# Altium project LaserLider.PrjPcb (part 3 of 4)

## Sheet VCSEL.SchDoc
size A4
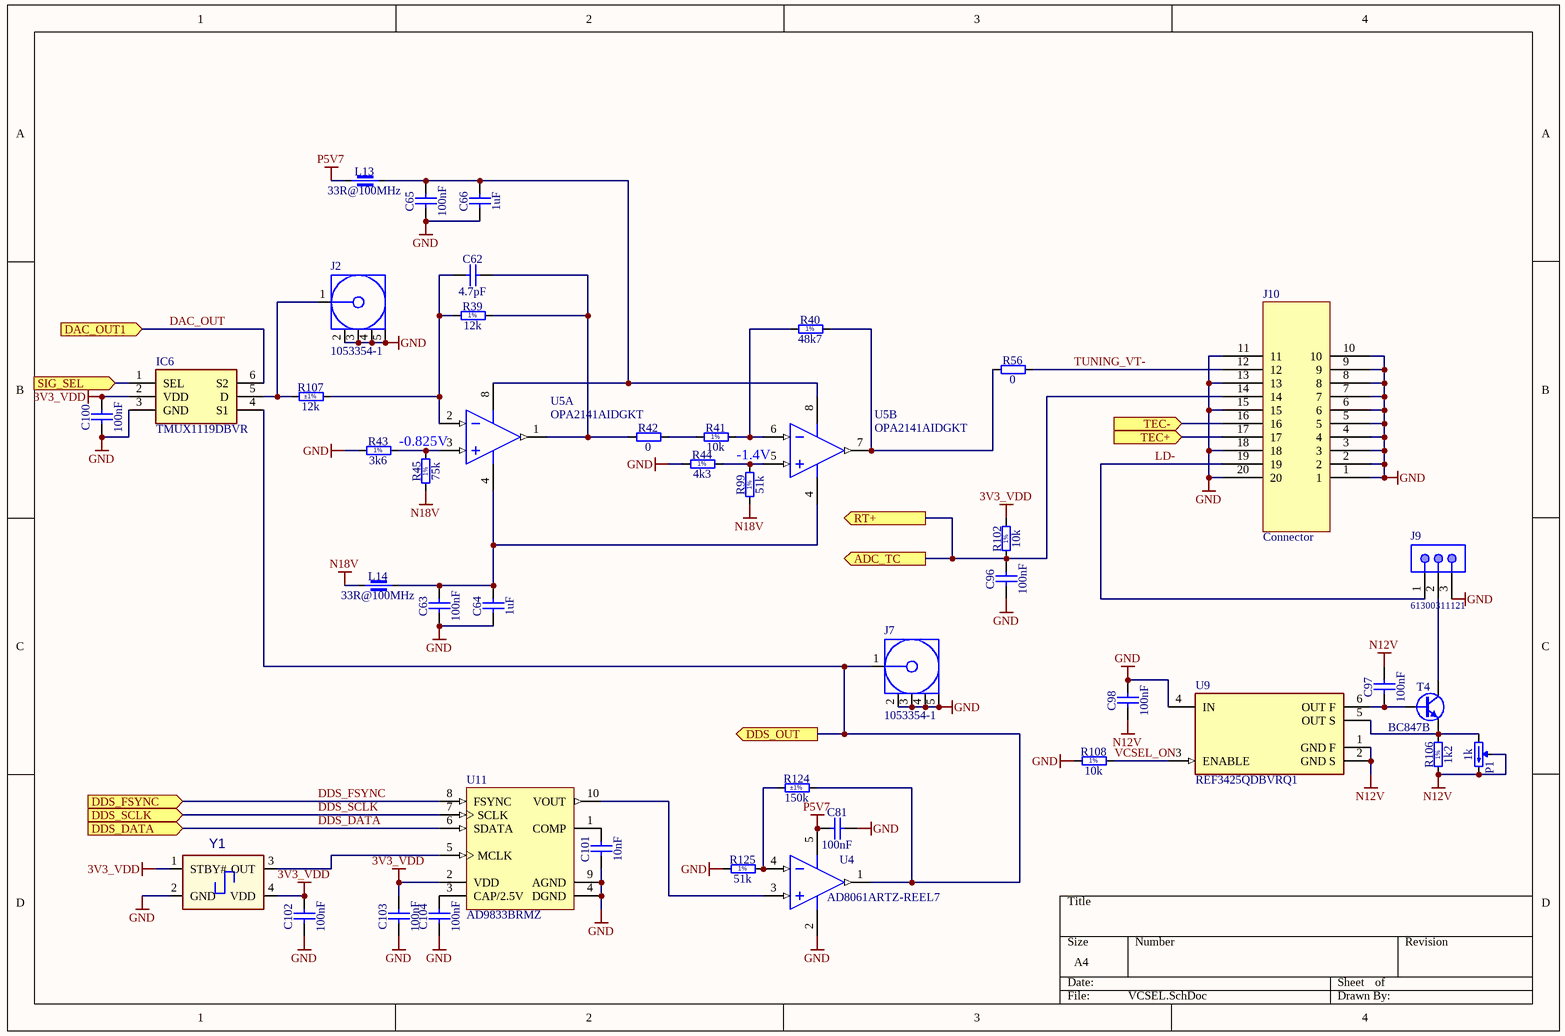
[diagram p4: VCSEL.SchDoc]

### Parts
C62  4.7pF  [CAPC1005X70N]
C63  100nF  [CAPC1608X87N]
C64  1uF  [CAPC1608X87N]
C65  100nF  [CAPC1005X55N]
C66  1uF  [CAPC1005X55N]
C81  100nF  [CAPC1005X55N]
C96  100nF  [CAPC1005X55N]
C97  100nF  [CAPC1005X55N]
C98  100nF  [CAPC1005X55N]
C100  100nF  [CAPC1005X55N]
C101  10nF  [CAPC1005X55N]
C102  100nF  [CAPC1005X55N]
C103  100nF  [CAPC1005X55N]
C104  100nF  [CAPC1005X55N]
IC6  TMUX1119DBVR  [SOT95P280X145-6N]
J2  1053354-1  [TECO-1053354-1_V]
J7  1053354-1  [TECO-1053354-1_V]
J9  61300311121  [61300311121]
J10  Connector  [VCSEL_CONNECTOR]
L13  33R@100MHz  [INDC1005X55N]
L14  33R@100MHz  [INDC1005X55N]
P1  1k  [TRIM_BOURNS_3266W]
R39  12k  [RESC1005X40N]
R40  48k7  [RESC1608X55N]
R41  10k  [RESC1005X40N]
R42  0  [RESC1005X40N]
R43  3k6  [RESC1005X40N]
R44  4k3  [RESC1005X40N]
R45  75k  [RESC1005X40N]
R56  0  [RESC1005X40N]
R99  51k  [RESC1005X40N]
R102  10k  [RESC1005X40N]
R106  1k2  [RESC1005X40N]
R107  12k  Tolerance: ±1%  [RESC1005X40N]
R108  10k  [RESC1005X40N]
R124  150k  Tolerance: ±1%  [RESC1005X40N]
R125  51k  [RESC1005X40N]
T4  BC847B  [SOT95P230X110-3N]
U4  AD8061ARTZ-REEL7  [ADI-RJ-5_L]
U5  OPA2141AIDGKT  [DGK0008A_M]  (parts A,B of 2)
U9  REF3425QDBVRQ1  [FP-DBV0006A-MFG]
U11  AD9833BRMZ  [ADI-RM-10_M]
Y1  OSCILLATOR_4P_nSTBY  [OSCILLATOR_CDFN_L2.5W2.0H0.85]  (value not drawn)

### Ports
ADC_TC (out), DAC_OUT1 (in), DDS_DATA (in), DDS_FSYNC (in), DDS_OUT (out), DDS_SCLK (in), RT+ (out), SIG_SEL (in), TEC+ (in), TEC- (in)

### Nets
3V3_VDD: C100.2 C102.2 C103.2 IC6.2(VDD) R102.2 U11.2(VDD) Y1.1(STBY#) Y1.4(VDD)
GND: C63.1 C64.1 C65.1 C66.1 C81.2 C96.1 C98.2 C100.1 C101.1 C102.1 C103.1 C104.1 IC6.3(GND) J2.2 J2.3 J2.4 J2.5 J7.2 J7.3 J7.4 J7.5 J9.3 J10.1 J10.2 J10.3 J10.4 J10.5 J10.6 J10.7 J10.8 J10.9 J10.10 J10.11 J10.13 J10.15 J10.18 J10.20 R43.1 R44.1 R108.1 R125.1 U4.2(-VS) U9.4(IN) U11.4(DGND) U11.9(AGND) Y1.2(GND)
N12V: C97.2 C98.1 P1.2(W) P1.3(CW) R106.1 U9.1(GND_F) U9.2(GND_S)
N18V: L14.1 R45.1 R99.1
P5V7: C81.1 L13.1 U4.5(+VS)
ADC_TC: C96.2 J10.14 R102.1 ; port ADC_TC, port RT+
COMP_IMP: IC6.4(S1) J7.1 R124.2 U4.1(VOUT) ; port DDS_OUT
DAC_OUT: IC6.6(S2) ; port DAC_OUT1
DDS_DATA: U11.6(SDATA) ; port DDS_DATA
DDS_FSYNC: U11.8(FSYNC) ; port DDS_FSYNC
DDS_SCLK: U11.7(SCLK) ; port DDS_SCLK
LD-: J9.1 J10.19
SIG_SEL: IC6.1(SEL) ; port SIG_SEL
TUNING_VT-: J10.12 R56.2
VCSEL_ON: R108.2 U9.3(ENABLE)
NetADN1_10: J10.16 ; port TEC-
NetADN1_17: J10.17 ; port TEC+
NetC62_1: C62.1 R39.1 R107.2 U5.2(IN_A-)
NetC62_2: C62.2 R39.2 R42.1 U5.1(OUT_A)
NetC63_2: C63.2 C64.2 L14.2 U5.4(V-)
NetC65_2: C65.2 C66.2 L13.2 U5.8(V+)
NetC97_1: C97.1 T4.1(B) U9.6(OUT_F)
NetC101_2: C101.2 U11.1(COMP)
NetC104_2: C104.2 U11.3(CAP/2.5V)
NetIC6_5: IC6.5(D) J2.1 R107.1
NetJ9_2: J9.2 T4.3(C)
NetP1_1: P1.1(CCW) R106.2 T4.2(E) U9.5(OUT_S)
NetR40_1: R40.1 R41.2 U5.6(IN_B-)
NetR40_2: R40.2 R56.1 U5.7(OUT_B)
NetR41_1: R41.1 R42.2
NetR43_2: R43.2 R45.2 U5.3(IN_A+)
NetR44_2: R44.2 R99.2 U5.5(IN_B+)
NetR124_1: R124.1 R125.2 U4.4(-IN)
NetU4_3: U4.3(+IN) U11.10(VOUT)
NetU11_5: U11.5(MCLK) Y1.3(OUT)

### Notes on the sheet
- -0.825V
- -1.4V
- (in symbol R0402_1K2_1%_0.0625W_100PPM) 1%
- (in symbol R0402_3K6_1%_0.0625W_100PPM) 1%
- (in symbol R0402_4K3_1%_0.0625W_100PPM) 1%
- (in symbol R0402_10K_1%_0.0625W_100PPM) 1%
- (in symbol R0402_12K_1%_0.0625W_100PPM) 1%
- (in symbol R0402_51K_1%_0.0625W_100PPM) 1%
- (in symbol R0402_75K_1%_0.0625W_100PPM) 1%
- (in symbol R0603_48K7_1%_0.1W_100PPM) 1%

### Library data of the parts
C62 = CC0402_4.7PF_50V_0.25PF_C0G_VISHAY_VJ_NON-MAGNETIC: Non-polarised capacitor; Part Description: Surface Mount Multilayer Ceramic Chip Capacitors for Non-Magnetic Applications (IR Reflow Soldering); Manufacturer: VISHAY VITRAMON; Manufacturer Part Number: VJ0402A4R7CCAA; Voltage: 50V; TC: C0G/NP0; Tolerance: ±0.25pF; Part Number: CC0402_4.7PF_50V_0.25PF_C0G_VISHAY_VJ_NON-MAGNETIC; Component Kind: Standard; Component Type: Standard; Pin Count: 2; Value: 4.7pF; Status: Not Recommended; Case: 0402; Mounted: Yes; Socket: No; SMD: Yes; Sense: No; ComponentHeight: 0.64mm; HelpURL: \\cern.ch\dfs\Applications\Altium\Datasheets\CC0402_VISHAY_VJ_NON-MAGNETIC.pdf; Author: CERN DEM MR; CreateDate: 03.03.2017; LatestRevisionDate: 03.03.2017
C63 = CC0603_100NF_50V_10%_X5R: Non-polarised capacitor; Part Description: SMD Multilayer Chip Ceramic Capacitor; Manufacturer: GENERIC; Manufacturer1 Part Number: C1608X5R1H104K080; Voltage: 50V; TC: X5R; Tolerance: ±10%; Part Number: CC0603_100NF_50V_10%_X5R; Component Kind: Standard; Component Type: Standard; Pin Count: 2; Value: 100nF; Status: None; Manufacturer Part Number: CC0603_100NF_50V_10%_X5R; Case: 0603; Mounted: Yes; Socket: No; SMD: Yes; Sense: No; Manufacturer1 Example: TDK; Manufacturer1 ComponentHeight: 0.9mm; HelpURL: \\cern.ch\dfs\Applications\Altium\Datasheets\CC0603_X5R_TDK_C.pdf; Author: CERN DEM MR; CreateDate: 08.01.2016; LatestRevisionDate: 08.01.2016
C64 = CC0603_1UF_25V_10%_X7R: Non-polarised capacitor; Part Description: SMD Multilayer Chip Ceramic Capacitor; Manufacturer: GENERIC; Manufacturer1 Part Number: GRM188R71E105KA12D; Voltage: 25V; TC: X7R; Tolerance: ±10%; Part Number: CC0603_1UF_25V_10%_X7R; Component Kind: Standard; Component Type: Standard; Pin Count: 2; Value: 1uF; Status: None; Manufacturer Part Number: CC0603_1UF_25V_10%_X7R; Case: 0603; Mounted: Yes; Socket: No; SMD: Yes; Sense: No; Manufacturer1 Example: MURATA; Manufacturer1 ComponentHeight: 0.9mm; HelpURL: \\cern.ch\dfs\Applications\Altium\Datasheets\CC0603_X7R_MURATA.pdf; Author: CERN DEM JLC; CreateDate: 18.01.2011; LatestRevisionDate: 18.01.2011
C65 C81 C96-C98 C100 C102-C104 = CC0402_100NF_16V_10%_X7R: Non-polarised capacitor; Part Description: SMD Multilayer Chip Ceramic Capacitor; Manufacturer: GENERIC; Manufacturer1 Part Number: GRM155R71C104KA88D; Voltage: 16V; TC: X7R; Tolerance: ±10%; Part Number: CC0402_100NF_16V_10%_X7R; Component Kind: Standard; Component Type: Standard; Pin Count: 2; Value: 100nF; Status: Not Recommended; Manufacturer Part Number: CC0402_100NF_16V_10%_X7R; Case: 0402; Mounted: Yes; Socket: No; SMD: Yes; Sense: No; Manufacturer1 Example: MURATA; Manufacturer1 ComponentHeight: 0.55mm; HelpURL: \\cern.ch\dfs\Applications\Altium\Datasheets\CC0402_X7R_MURATA_GRM.pdf; Author: CERN DEM JLC; CreateDate: 05.12.2013; LatestRevisionDate: 03.12.2007
C66 = CC0402_1UF_16V_10%_X5R: Non-polarised capacitor; Part Description: SMD Multilayer Chip Ceramic Capacitor; Manufacturer: GENERIC; Manufacturer1 Part Number: C1005X5R1C105KT; Voltage: 16V; TC: X5R; Tolerance: ±10%; Part Number: CC0402_1UF_16V_10%_X5R; Component Kind: Standard; Component Type: Standard; Pin Count: 2; Value: 1uF; Status: Preferred; Manufacturer Part Number: CC0402_1UF_16V_10%_X5R; Case: 0402; Mounted: Yes; Socket: No; SMD: Yes; Sense: No; Manufacturer1 Example: TDK; Manufacturer1 ComponentHeight: 0.55mm; HelpURL: \\cern.ch\dfs\Applications\Altium\Datasheets\CC0402_X5R_TDK_C.pdf; Author: CERN DEM JLC; CreateDate: 25.10.2012; LatestRevisionDate: 25.10.2012
C101 = CC0402_10NF_16V_10%_X7R: Non-polarised capacitor; Part Description: SMD Multilayer Chip Ceramic Capacitor; Manufacturer: GENERIC; Manufacturer1 Part Number: 223878715636; Voltage: 16V; TC: X7R; Tolerance: ±10%; Part Number: CC0402_10NF_16V_10%_X7R; Component Kind: Standard; Component Type: Standard; Pin Count: 2; Value: 10nF; Status: Not Recommended; Manufacturer Part Number: CC0402_10NF_16V_10%_X7R; Case: 0402; Mounted: Yes; Socket: No; SMD: Yes; Sense: No; Manufacturer1 Example: PHYCOMP; Manufacturer1 ComponentHeight: 0.55mm; HelpURL: \\cern.ch\dfs\Applications\Altium\Datasheets\CC0402_X7R_PHYCOMP.pdf; Author: CERN DEM JLC; CreateDate: 03.12.2007; LatestRevisionDate: 03.12.2007
IC6 = TMUX1119DBVR: Integrated Circuit; Manufacturer_Name: Texas Instruments; Datasheet Link: https://www.ti.com/lit/gpn/TMUX1119; Height: 1.45mm; Manufacturer_Part_Number: TMUX1119DBVR
J2 J7 = CMP-2000-05830-1: Female Coaxial Connector, Pitch 2.55 mm, Height 9.5 mm, Tail Length 3.9 mm, RoHS, Bulk; Manufacturer: TE Connectivity; Dynamic Catalog: SMA; Impedance: 50Ohm; Contact Termination: Solder; Connector Type: Jack,FemaleSockets; 3D Model: 1053354-1.pdf; Other Names: 2062000000 / A30046; Datasheet Version: Rev. B, 05/2011; Package Reference: 1053354-1; RoHS Information: 1053354-1StatementofCompliance; Series: SMA; Connector Style: SMA; Family: CoaxialConnectors(RF); Category: Connectors,Interconnects; Fastening Type: Threaded; Standard Package: 125; Mounting Type: ThroughHole; Packaging: Bulk; Datasheet URL: http://www.te.com/commerce/DocumentDelivery/DDEController?Action=srchrtrv&DocNm=1053354&DocType=Customer+Drawing&DocLang=English; Mounting Technology: ThroughHole; Manufacturer URL: http://www.te.com/; Package Description: Female Coaxial Connector, Pitch 2.55 mm, Height 9.5 mm, Tail Length 3.9 mm
J9 = 61300311121: WR-PHD Pin Header, THT, pitch 2.54mm, Single Row, Vertical, 3pin; Pin Number: 3; Gender: Male; Rated Current: 3A; Working Voltage: 250VAC; Withstanding Voltage: 500VAC; Contact Resistance: 20mOhm; ComponentLink1Description: Manufacturer; ComponentLink1URL: http://www.we-online.de; ComponentLink2Description: Datasheet; ComponentLink2URL: https://katalog.we-online.de/em/datasheet/6130xx11121.pdf; Part Number: 61300311121; Published Date: June 2019; Publisher: Wurth Elektronik; Pitch: 2.54mm; Operating Temperature: -40 to +105degC; Mounting Technology: THT; Packaging: Bag; Row Number: Single; Orientation: Vertical
J10 = VCSEL_CONNECTOR: VCSEL connector
L13 L14 = IND0402_MURATA_BLM15PX330SN1D: Part Description: SMD EMIFIL Chip Ferrite Bead; Manufacturer: MURATA; Power: 3A; Resistance: 0.022R; Tolerance: ±25%; Part Number: IND0402_MURATA_BLM15PX330SN1D; Component Kind: Standard; Component Type: Standard; Pin Count: 2; Value: 33R@100MHz; Status: None; Manufacturer Part Number: BLM15PX330SN1D; Case: 0402; Mounted: Yes; Socket: No; SMD: Yes; Sense: No; ComponentHeight: 0.55mm; HelpURL: \\cern.ch\dfs\Applications\Altium\Datasheets\IND0402_MURATA_BLM15PX.pdf; Author: CERN DEM JMW; CreateDate: 19.02.2014; LatestRevisionDate: 25.10.2018
P1 = TRIM_12T_1K_BOURNS_3266W-1-102LF: Trimming Potentiometer; Part Description: 12 Turn Trimming Potentiometer (Top Adjustment); Manufacturer: BOURNS; Power: 0.25W; TC: ±100ppm/°C; Tolerance: ±10%; PressFit: No; Part Number: TRIM_12T_1K_BOURNS_3266W-1-102LF; Component Kind: Standard; Component Type: Standard; Pin Count: 3; Value: 1k; Manufacturer Part Number: 3266W-1-102LF; Case: 3266W; Mounted: Yes; Socket: No; SMD: No; Sense: No; ComponentHeight: 7.75mm; HelpURL: \\cern.ch\dfs\Applications\Altium\Datasheets\TRIM_BOURNS_3266W.pdf; Author: CERN DEM JLC; CreateDate: 10.06.2008; LatestRevisionDate: 28.11.2012
R39 = R0402_12K_1%_0.0625W_100PPM: Resistor - 1%; Part Description: General Purpose Thick Film Chip Resistor; Manufacturer: GENERIC; Manufacturer1 Part Number: 232270671203L; TC: ±100ppm/°C; PressFit: No; Part Number: R0402_12K_1%_0.0625W_100PPM; Component Kind: Standard; Component Type: Standard; Pin Count: 2; Value: 12k; Status: Not Recommended; Power: 0.0625W; Tolerance: ±1%; Manufacturer Part Number: R0402_12K_1%_0.0625W_100PPM; Case: 0402; Mounted: Yes; Sense: No; Socket: No; SMD: Yes; Manufacturer1 Example: YAGEO PHYCOMP; Manufacturer1 ComponentHeight: 0.4mm; HelpURL: \\cern.ch\dfs\Applications\Altium\Datasheets\R0402_Phycomp_RC0402.pdf; Author: CERN DEM JLC; CreateDate: 03.12.2007; LatestRevisionDate: 17.10.2012
R40 = R0603_48K7_1%_0.1W_100PPM: Resistor - 1%; Part Description: General Purpose Thick Film Chip Resistor; Manufacturer: GENERIC; Manufacturer1 Part Number: CRCW060348K7FKEA; Power: 0.1W; TC: ±100ppm/°C; PressFit: No; Part Number: R0603_48K7_1%_0.1W_100PPM; Component Kind: Standard; Component Type: Standard; Pin Count: 2; Value: 48k7; Status: Preferred; Tolerance: ±1%; Manufacturer Part Number: R0603_48K7_1%_0.1W_100PPM; Case: 0603; Mounted: Yes; Sense: No; Socket: No; SMD: Yes; Manufacturer1 Example: VISHAY; Manufacturer1 ComponentHeight: 0.55mm; HelpURL: \\cern.ch\dfs\Applications\Altium\Datasheets\R0603_VISHAY_CRCW e3.pdf; Author: CERN DEM JLC; CreateDate: 15.07.2010; LatestRevisionDate: 11.12.2013
R41 R102 R108 = R0402_10K_1%_0.0625W_100PPM: Resistor - 1%; Part Description: General Purpose Thick Film Chip Resistor; Manufacturer: GENERIC; Manufacturer1 Part Number: 232270671003L; TC: ±100ppm/°C; PressFit: No; Part Number: R0402_10K_1%_0.0625W_100PPM; Component Kind: Standard; Component Type: Standard; Pin Count: 2; Value: 10k; Status: Not Recommended; Power: 0.0625W; Tolerance: ±1%; Manufacturer Part Number: R0402_10K_1%_0.0625W_100PPM; Case: 0402; Mounted: Yes; Sense: No; Socket: No; SMD: Yes; Manufacturer1 Example: YAGEO PHYCOMP; Manufacturer1 ComponentHeight: 0.4mm; HelpURL: \\cern.ch\dfs\Applications\Altium\Datasheets\R0402_Phycomp_RC0402.pdf; Author: CERN DEM JLC; CreateDate: 03.12.2007; LatestRevisionDate: 17.10.2012
R42 R56 = R0402_0R_JUMPER: Resistor; Part Description: 1A (0.05R Max DC Resistance) Zero Ohm Jumper; Manufacturer: GENERIC; Manufacturer1 Part Number: 232270591001L; PressFit: No; Part Number: R0402_0R_JUMPER; Component Kind: Standard; Component Type: Standard; Pin Count: 2; Value: 0; Status: Not Recommended; Manufacturer Part Number: R0402_0R_JUMPER; Case: 0402; Mounted: Yes; Sense: No; Socket: No; SMD: Yes; Manufacturer1 Example: YAGEO PHYCOMP; Manufacturer1 ComponentHeight: 0.4mm; HelpURL: \\cern.ch\dfs\Applications\Altium\Datasheets\R0402_Phycomp_RC0402.pdf; Author: CERN DEM JLC; CreateDate: 03.12.2007; LatestRevisionDate: 17.10.2012
R43 = R0402_3K6_1%_0.0625W_100PPM: Resistor - 1%; Part Description: General Purpose Thick Film Chip Resistor; Manufacturer: GENERIC; Manufacturer1 Part Number: 232270673602L; TC: ±100ppm/°C; PressFit: No; Part Number: R0402_3K6_1%_0.0625W_100PPM; Component Kind: Standard; Component Type: Standard; Pin Count: 2; Value: 3k6; Status: Not Recommended; Power: 0.0625W; Tolerance: ±1%; Manufacturer Part Number: R0402_3K6_1%_0.0625W_100PPM; Case: 0402; Mounted: Yes; Sense: No; Socket: No; SMD: Yes; Manufacturer1 Example: YAGEO PHYCOMP; Manufacturer1 ComponentHeight: 0.4mm; HelpURL: \\cern.ch\dfs\Applications\Altium\Datasheets\R0402_Phycomp_RC0402.pdf; Author: CERN DEM JLC; CreateDate: 03.12.2007; LatestRevisionDate: 17.10.2012
R44 = R0402_4K3_1%_0.0625W_100PPM: Resistor - 1%; Part Description: General Purpose Thick Film Chip Resistor; Manufacturer: GENERIC; Manufacturer1 Part Number: 232270674302L; TC: ±100ppm/°C; PressFit: No; Part Number: R0402_4K3_1%_0.0625W_100PPM; Component Kind: Standard; Component Type: Standard; Pin Count: 2; Value: 4k3; Status: Not Recommended; Power: 0.0625W; Tolerance: ±1%; Manufacturer Part Number: R0402_4K3_1%_0.0625W_100PPM; Case: 0402; Mounted: Yes; Sense: No; Socket: No; SMD: Yes; Manufacturer1 Example: YAGEO PHYCOMP; Manufacturer1 ComponentHeight: 0.4mm; HelpURL: \\cern.ch\dfs\Applications\Altium\Datasheets\R0402_Phycomp_RC0402.pdf; Author: CERN DEM JLC; CreateDate: 03.12.2007; LatestRevisionDate: 17.10.2012
R45 = R0402_75K_1%_0.0625W_100PPM: Resistor - 1%; Part Description: General Purpose Thick Film Chip Resistor; Manufacturer: GENERIC; Manufacturer1 Part Number: 232270677503L; TC: ±100ppm/°C; PressFit: No; Part Number: R0402_75K_1%_0.0625W_100PPM; Component Kind: Standard; Component Type: Standard; Pin Count: 2; Value: 75k; Status: Not Recommended; Power: 0.0625W; Tolerance: ±1%; Manufacturer Part Number: R0402_75K_1%_0.0625W_100PPM; Case: 0402; Mounted: Yes; Sense: No; Socket: No; SMD: Yes; Manufacturer1 Example: YAGEO PHYCOMP; Manufacturer1 ComponentHeight: 0.4mm; HelpURL: \\cern.ch\dfs\Applications\Altium\Datasheets\R0402_Phycomp_RC0402.pdf; Author: CERN DEM JLC; CreateDate: 03.12.2007; LatestRevisionDate: 17.10.2012
R99 R125 = R0402_51K_1%_0.0625W_100PPM: Resistor - 1%; Part Description: General Purpose Thick Film Chip Resistor; Manufacturer: GENERIC; Manufacturer1 Part Number: 232270674703L; TC: ±100ppm/°C; PressFit: No; Part Number: R0402_51K_1%_0.0625W_100PPM; Component Kind: Standard; Component Type: Standard; Pin Count: 2; Value: 51k; Status: Not Recommended; Power: 0.0625W; Tolerance: ±1%; Manufacturer Part Number: R0402_51K_1%_0.0625W_100PPM; Case: 0402; Mounted: Yes; Sense: No; Socket: No; SMD: Yes; Manufacturer1 Example: YAGEO PHYCOMP; Manufacturer1 ComponentHeight: 0.4mm; HelpURL: \\cern.ch\dfs\Applications\Altium\Datasheets\R0402_Phycomp_RC0402.pdf; Author: CERN DEM JLC; CreateDate: 03.12.2007; LatestRevisionDate: 17.10.2012
R106 = R0402_1K2_1%_0.0625W_100PPM: Resistor - 1%; Part Description: General Purpose Thick Film Chip Resistor; Manufacturer: GENERIC; Manufacturer1 Part Number: 232270671202L; TC: ±100ppm/°C; PressFit: No; Part Number: R0402_1K2_1%_0.0625W_100PPM; Component Kind: Standard; Component Type: Standard; Pin Count: 2; Value: 1k2; Status: Not Recommended; Power: 0.0625W; Tolerance: ±1%; Manufacturer Part Number: R0402_1K2_1%_0.0625W_100PPM; Case: 0402; Mounted: Yes; Sense: No; Socket: No; SMD: Yes; Manufacturer1 Example: YAGEO PHYCOMP; Manufacturer1 ComponentHeight: 0.4mm; HelpURL: \\cern.ch\dfs\Applications\Altium\Datasheets\R0402_Phycomp_RC0402.pdf; Author: CERN DEM JLC; CreateDate: 03.12.2007; LatestRevisionDate: 17.10.2012
R107 = R0402_12K_1%_0.0625W_100PPM: Resistor - 1%; Part Description: General Purpose Thick Film Chip Resistor; Manufacturer: GENERIC; Manufacturer1 Part Number: 232270671203L; PressFit: No; TC: ±100ppm/°C; Part Number: R0402_12K_1%_0.0625W_100PPM; Component Kind: Standard; Component Type: Standard; Pin Count: 2; Value: 12k; Status: Not Recommended; Manufacturer Part Number: R0402_12K_1%_0.0625W_100PPM; Case: 0402; Mounted: Yes; Sense: No; Socket: No; SMD: Yes; Manufacturer1 Example: YAGEO PHYCOMP; Manufacturer1 ComponentHeight: 0.4mm; HelpURL: \\cern.ch\dfs\Applications\Altium\Datasheets\R0402_Phycomp_RC0402.pdf; Author: CERN DEM JLC; CreateDate: 03.12.2007; LatestRevisionDate: 17.10.2012; Power: 0.0625W
R124 = R0402_150K_1%_0.0625W_100PPM: Resistor - 1%; Part Description: General Purpose Thick Film Chip Resistor; Manufacturer: GENERIC; Manufacturer1 Part Number: 232270671504L; TC: ±100ppm/°C; PressFit: No; Part Number: R0402_150K_1%_0.0625W_100PPM; Component Kind: Standard; Component Type: Standard; Pin Count: 2; Value: 150k; Status: Not Recommended; Power: 0.0625W; Manufacturer Part Number: R0402_150K_1%_0.0625W_100PPM; Case: 0402; Mounted: Yes; Sense: No; Socket: No; SMD: Yes; Manufacturer1 Example: YAGEO PHYCOMP; Manufacturer1 ComponentHeight: 0.4mm; HelpURL: \\cern.ch\dfs\Applications\Altium\Datasheets\R0402_Phycomp_RC0402.pdf; Author: CERN DEM JLC; CreateDate: 03.12.2007; LatestRevisionDate: 17.10.2012
T4 = BC847B: NPN Transistor; Part Description: 45V 100mA NPN general-purpose transistors; Manufacturer: NXP SEMICONDUCTORS; PressFit: No; Bonding: No; Part Number: BC847B; Component Kind: Standard; Component Type: Standard; Device: BC847B; PackageDescription: SOT23, 0.95mm Pitch; 3 Pin, 1.30mm W X 2.90mm L X 1.10mm H body, IPC Medium Density; Manufacturer Part Number: BC847B; Pin Count: 3; Case: SOT23-3; Mounted: Yes; Socket: No; SMD: Yes; Sense: No; ComponentHeight: 1.1mm; HelpURL: \\cern.ch\dfs\Applications\Altium\Datasheets\BC847B.pdf; Author: CERN DEM JLC; CreateDate: 14.06.2011; LatestRevisionDate: 14.06.2011
U4 = CMP-0384-01491-2: Single Channel Low Offset Voltage Operational Amplifier, 320 MHz BW, 650 V/us SR, Industrial, 5-pin SOT23 (RJ-5), Reel; Generic Part Number: AD8061; Manufacturer: Analog Devices; Iq/Amp: 9.5mA; V Span Min: 2.7V; Input Offset Voltage: 1mV; Input Bias Current: 350nA; Small Signal Bandwidth: 320MHz; Amplifiers Per Package: 1; V Span Max: 8V; PartNumber: AD8061ARTZ-REEL7; ComponentLink3Description: Package Specification; PackageReference: RJ-5; PackageVersion: 121608-A; RevisionNote: Symbol corrected, Pin 2 orientation reversed; ComponentLink1URL: http://www.analog.com/en/index.html; ComponentLink1Description: Manufacturer URL; ComponentLink2URL: http://www.analog.com/static/imported-files/data_sheets/AD8061_8062_8063.pdf; ComponentLink2Description: Datasheet; Code_JEDEC: MO-178-AA; Slew Rate: 650V/us; DatasheetVersion: Rev. G; PackageDescription: 5-Pin Small Outline Transistor Package, Body 2.9 x 1.6 mm, Pitch 0.95 mm; ComponentLink3URL: http://www.analog.com/static/imported-files/packages/PKG_PDF/SOT-23(RJ)/RJ_5.pdf; Mounting Technology: Surface Mount
U5 = CMP-0272-01226-3: 10 MHz, Single Supply, Low Noise, JFET Precision Amplifier, 4.5 to 36 V, -40 to 125 degC, 8-pin SOP (DGK8), Green (RoHS & no Sb/Br); Manufacturer: Texas Instruments; CMRR(Min)(dB): 120; IIB(Max)(pA): 20; Number of Channels: 2; Rating: Catalog; Packing: SMALL T&R; Total Supply Voltage(Max)(+5V is 5, +/-5V is 10): 36; Iq per channel(Max)(mA): 2.3; Vio (25C)(Max)(mV): 3.5; Total Supply Voltage(Min)(+5V is 5, +/-5V is 10): 4.5; Sub Family: High Supply Voltage Amplifier (>=30V), Low Noise Amp (<=10nV/rtHz), Precision Amplifier; GBW(Typ)(MHz): 10; Eco-Plan: Green (RoHS & no Sb/Br); ComponentLink1Description: Manufacturer URL; ComponentLink1URL: http://www.ti.com/; Slew Rate(Typ)(V/us): 20; PackageDescription: 8-Pin Thin Small Outline, Body 3 x 3 mm, Pitch 0.65 mm; DatasheetVersion: SBOS510B; ComponentLink2Description: Datasheet; ComponentLink3URL: http://www.ti.com/litv/pdf/mpds028d; ComponentLink3Description: Package Specification; PackageReference: DGK0008A; PackageVersion: 4073329/E, 05/2006; PartNumber: OPA2141AIDGKT; Mounting Technology: Surface Mount; Code_JEDEC: MO-187; ComponentLink2URL: http://www.ti.com/lit/ds/symlink/opa2141.pdf; Offset Drift(Typ)(uV/C): 2
U9 = CMP-04916-000005-1: IC VREF SERIES 0.05% SOT23-6; Manufacturer: Texas Instruments; Output Voltage: 2.5V; Max Supply Voltage: 12V; Output Type: Fixed; Automotive Grade: Grade 1; Number Of Outputs: 1; Output Current: 10mA; Nominal Supply Current: 72uA; Standoff Height: 0mm; Temperature: -40°C to +125°C; Temperature Range Low: -40°C; ComponentLink2Description: Datasheet; Manufacturer Part Number: REF3425QDBVRQ1; Device Class L2: Power Management ICs; RoHS: TRUE; Temperature Range High: +125°C; Digikey Description: IC VREF SERIES 0.05% SOT23-6; Octopart: https://octopart.com/ref3433qdbvrq1-texas+instruments-95842010; ComponentLink2URL: https://www.ti.com/lit/ds/symlink/ref34-q1.pdf; Mouser Description: Automotive low-drift low-power small-footprint series voltage reference 6-SOT-23 -40 to 125; Package: DBV0006A; Ambient Temperature Range High: +125°C; Device Class L1: Integrated Circuits (ICs); Device Class L3: Voltage References; Category: IC; Height: 1.45mm; Lead Free: Yes; Automotive: Yes; Reference Type: Series; Ambient Temperature Range Low: -40°C
U11 = CMP-0293-00077-1: Low Power, 12.65 mW, 2.3 V to 5.5 V, Programmable Waveform Generator, 10-Bit, Serial, RM-10, 50 Tube, Pb-Free; Resolution (Bits): 10bit; Compliance Range (V): 650mV; FS Iout (mA nom): 3mA; REFCLK Multiplier: No; Master fclk: 25MHz; I Supply total (max): 5.5mA; Tuning Word Width (bits): 28bit; Code_JEDEC: MO-187-BA; DatasheetVersion: Rev. D; PackageVersion: 5/8/2005; ComponentLink1URL: www.analog.com; ComponentLink3Description: Package Specification; PackageDescription: 10-Lead Mini Small Outline Package [MSOP]; I/O Interface: Serial; ComponentLink2Description: Datasheet; ComponentLink1Description: Manufacturer URL; PackageReference: RM-10; ComponentLink2URL: http://www.analog.com/static/imported-files/data_sheets/AD9833.pdf; ComponentLink3URL: http://www.analog.com/static/imported-files/packages/PKG_PDF/MSOP%28RM%29/RM_10.pdf
Y1 = MIC8253: Manufacturer 1: Microchip Technology; Manufacturer Part Number 1: DSC1001CI2-025.0000; Description_: MCHP CLOCK OSCILLATOR SINGLE 25MHZ DSC1001CI2-025.0000 CDFN-4; Dev Tools Status: Production; Value: 25MHz; Owner: Sam Charles; Populated: YES; Revision: 1; MCHP-ID: MIC8253; Symbol: OSCILLATOR_4P_nSTBY; Status: MCL Design; ComponentLink1URL: https://chn-vm-apps.microchip.com/mchprepo/parts/Datasheets/20005529B.pdf; ComponentLink1Description: SVN Datasheet; ComponentLink2URL: C:\ALTIUM_WORK\00001_MCHP-CDB\Datasheets\20005529B.pdf; ComponentLink2Description: Local Datasheet; ComponentLink3URL: C:\ALTIUM_WORK\00001_MCHP-CDB\Library\LibraryRefs\OSCILLATOR_4P_nSTBY.SchLib; ComponentLink3Description: Open Symbol; ComponentLink4URL: C:\ALTIUM_WORK\00001_MCHP-CDB\Library\Footprints\OSCILLATOR_CDFN_L2.5W2.0H0.85.PcbLib; ComponentLink4Description: Open Footprint; ComponentLink5Description: Open Footprint 2; ComponentLink6Description: Open Footprint 3; ComponentLink7Description: Open Footprint 4; Category: MCHP-Clock/Timing; Type: Oscillator; Supplier 1: Digi-Key; Supplier Part Number 1: DSC1001CI2-025.0000CT-ND; Quantity Override: 1

## Sheet Photoreciever.SchDoc
size A4
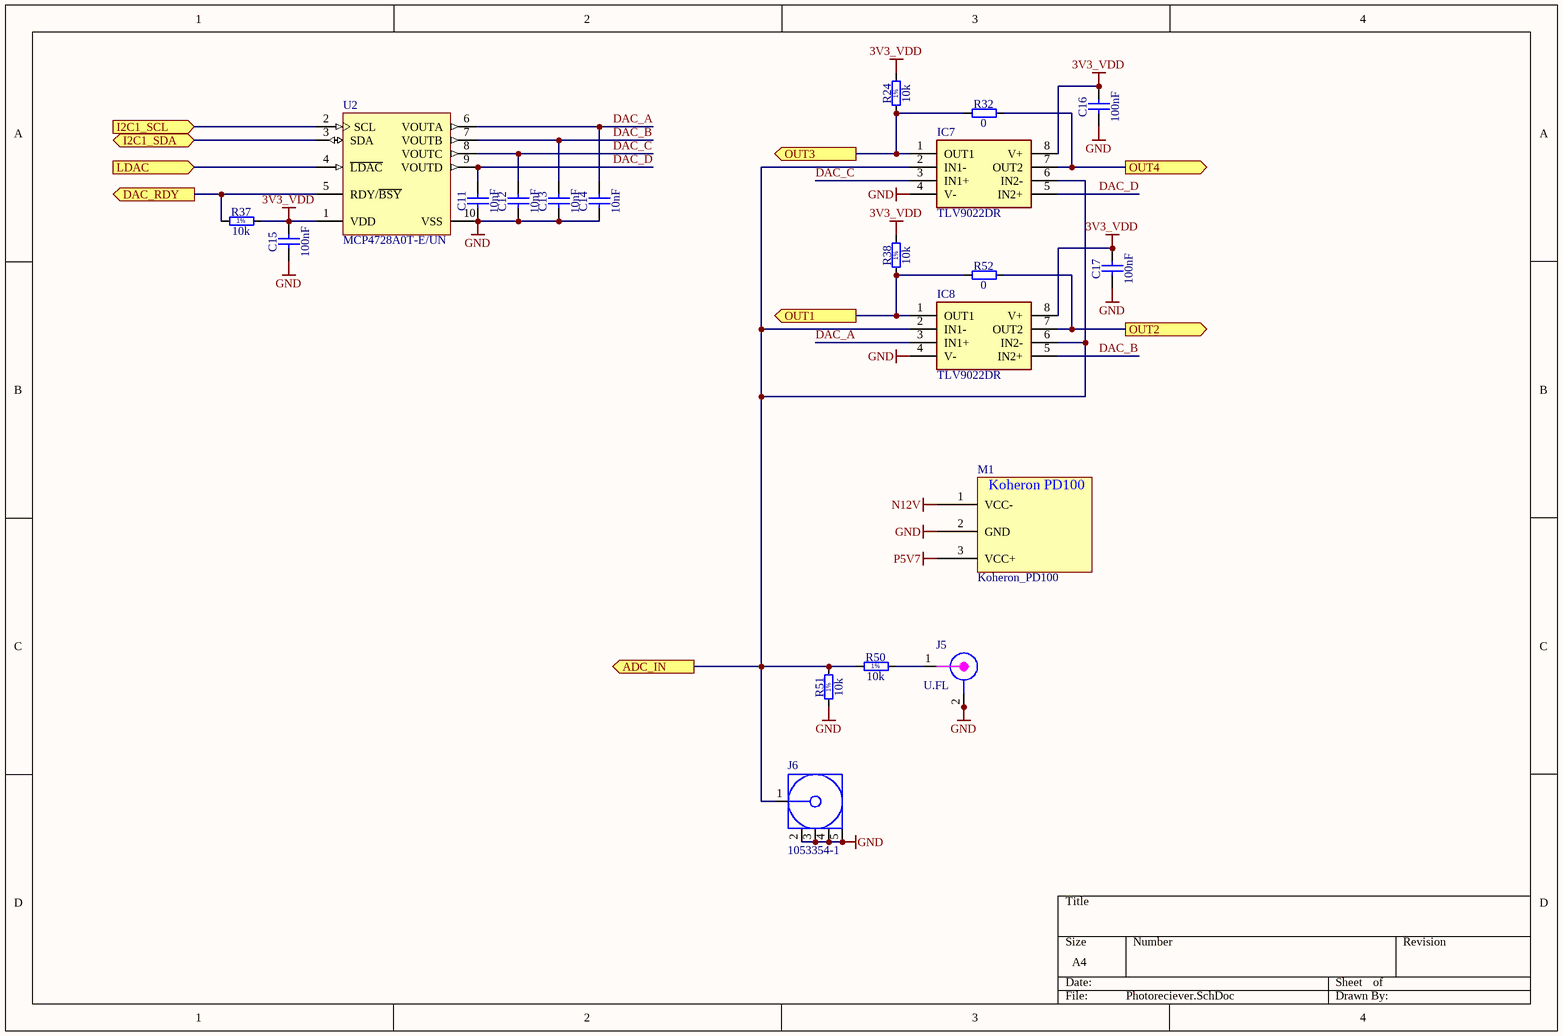
[diagram p5: Photoreciever.SchDoc]

### Parts
C11  10nF  [CAPC1005X55N]
C12  10nF  [CAPC1005X55N]
C13  10nF  [CAPC1005X55N]
C14  10nF  [CAPC1005X55N]
C15  100nF  [CAPC1005X55N]
C16  100nF  [CAPC1005X55N]
C17  100nF  [CAPC1005X55N]
IC7  TLV9022DR  [SOIC127P600X175-8N]
IC8  TLV9022DR  [SOIC127P600X175-8N]
J5  U.FL  [CON_UFL_HIROSE_RECEPTACLE]
J6  1053354-1  [TECO-1053354-1_V]
M1  Koheron_PD100  [Koheron_PD100]
R24  10k  [RESC1005X40N]
R32  0  [RESC1005X40N]
R37  10k  [RESC1005X40N]
R38  10k  [RESC1005X40N]
R50  10k  [RESC1005X40N]
R51  10k  [RESC1005X40N]
R52  0  [RESC1005X40N]
U2  MCP4728A0T-E/UN  [MSOP-UN10_M]

### Ports
ADC_IN (out), DAC_RDY (out), I2C1_SCL (in), I2C1_SDA (bidir), LDAC (in), OUT1 (out), OUT2 (out), OUT3 (out), OUT4 (out)

### Nets
3V3_VDD: C15.2 C16.2 C17.2 IC7.8(V+) IC8.8(V+) R24.2 R37.2 R38.2 U2.1(VDD)
GND: C11.1 C12.1 C13.1 C14.1 C15.1 C16.1 C17.1 IC7.4(V-) IC8.4(V-) J5.2 J5.2a(GND) J6.2 J6.3 J6.4 J6.5 M1.2(GND) R51.1 U2.10(VSS)
N12V: M1.1(VCC-)
P5V7: M1.3(VCC+)
ADC_IN: IC7.2(IN1-) IC7.6(IN2-) IC8.2(IN1-) IC8.6(IN2-) J6.1 R50.1 R51.2 ; port ADC_IN
DAC_A: C14.2 IC8.3(IN1+) U2.6(VOUTA)
DAC_B: C13.2 IC8.5(IN2+) U2.7(VOUTB)
DAC_C: C12.2 IC7.3(IN1+) U2.8(VOUTC)
DAC_D: C11.2 IC7.5(IN2+) U2.9(VOUTD)
DAC_RDY: R37.1 U2.5(RDY/~{BSY}) ; port DAC_RDY
EXTI0: IC8.1(OUT1) R38.1 R52.1 ; port OUT1
EXTI1: IC8.7(OUT2) R52.2 ; port OUT2
EXTI2: IC7.1(OUT1) R24.1 R32.1 ; port OUT3
EXTI3: IC7.7(OUT2) R32.2 ; port OUT4
I2C1_SCL: U2.2(SCL) ; port I2C1_SCL
I2C1_SDA: U2.3(SDA) ; port I2C1_SDA
LDAC: U2.4(~{LDAC}) ; port LDAC
NetJ5_1: J5.1 R50.2

### Notes on the sheet
- (in symbol Koheron_PD100) Koheron PD100
- (in symbol R0402_10K_1%_0.0625W_100PPM) 1%

### Library data of the parts
C11-C14 = CC0402_10NF_16V_10%_X7R: as C101 on sheet VCSEL; Part Number: CC0402_10NF_16V_10%_X7R; Component Kind: Standard; Component Type: Standard; Pin Count: 2; Value: 10nF; Status: Not Recommended; Manufacturer Part Number: CC0402_10NF_16V_10%_X7R; Case: 0402; Mounted: Yes; Socket: No; SMD: Yes; Sense: No; Manufacturer1 Example: PHYCOMP; Manufacturer1 ComponentHeight: 0.55mm; HelpURL: \\cern.ch\dfs\Applications\Altium\Datasheets\CC0402_X7R_PHYCOMP.pdf; Author: CERN DEM JLC; CreateDate: 03.12.2007; LatestRevisionDate: 03.12.2007
C15-C17 = CC0402_100NF_16V_10%_X7R: as C65 on sheet VCSEL; Part Number: CC0402_100NF_16V_10%_X7R; Component Kind: Standard; Component Type: Standard; Pin Count: 2; Value: 100nF; Status: Not Recommended; Manufacturer Part Number: CC0402_100NF_16V_10%_X7R; Case: 0402; Mounted: Yes; Socket: No; SMD: Yes; Sense: No; Manufacturer1 Example: MURATA; Manufacturer1 ComponentHeight: 0.55mm; HelpURL: \\cern.ch\dfs\Applications\Altium\Datasheets\CC0402_X7R_MURATA_GRM.pdf; Author: CERN DEM JLC; CreateDate: 05.12.2013; LatestRevisionDate: 03.12.2007
IC7 IC8 = TLV9022DR: Integrated Circuit; Manufacturer_Name: Texas Instruments; Datasheet Link: https://www.arrow.com/en/products/tlv9022dr/texas-instruments; Height: 1.75mm; Manufacturer_Part_Number: TLV9022DR
J5 = CON_UFL_SMD: UFL; Supplier 1: Newark; Supplier Part Number 1: 50P8856
J6 = CMP-2000-05830-1: as J2 on sheet VCSEL; Datasheet Version: Rev. B, 05/2011; Package Reference: 1053354-1; RoHS Information: 1053354-1StatementofCompliance; Series: SMA; Connector Style: SMA; Family: CoaxialConnectors(RF); Category: Connectors,Interconnects; Fastening Type: Threaded; Standard Package: 125; Mounting Type: ThroughHole; Packaging: Bulk; Datasheet URL: http://www.te.com/commerce/DocumentDelivery/DDEController?Action=srchrtrv&DocNm=1053354&DocType=Customer+Drawing&DocLang=English; Mounting Technology: ThroughHole; Manufacturer URL: http://www.te.com/; Package Description: Female Coaxial Connector, Pitch 2.55 mm, Height 9.5 mm, Tail Length 3.9 mm
R24 R37 R38 R50 R51 = R0402_10K_1%_0.0625W_100PPM: as R41 on sheet VCSEL; Part Number: R0402_10K_1%_0.0625W_100PPM; Component Kind: Standard; Component Type: Standard; Pin Count: 2; Value: 10k; Status: Not Recommended; Power: 0.0625W; Tolerance: ±1%; Manufacturer Part Number: R0402_10K_1%_0.0625W_100PPM; Case: 0402; Mounted: Yes; Sense: No; Socket: No; SMD: Yes; Manufacturer1 Example: YAGEO PHYCOMP; Manufacturer1 ComponentHeight: 0.4mm; HelpURL: \\cern.ch\dfs\Applications\Altium\Datasheets\R0402_Phycomp_RC0402.pdf; Author: CERN DEM JLC; CreateDate: 03.12.2007; LatestRevisionDate: 17.10.2012
R32 R52 = R0402_0R_JUMPER: as R42 on sheet VCSEL; Part Number: R0402_0R_JUMPER; Component Kind: Standard; Component Type: Standard; Pin Count: 2; Value: 0; Status: Not Recommended; Manufacturer Part Number: R0402_0R_JUMPER; Case: 0402; Mounted: Yes; Sense: No; Socket: No; SMD: Yes; Manufacturer1 Example: YAGEO PHYCOMP; Manufacturer1 ComponentHeight: 0.4mm; HelpURL: \\cern.ch\dfs\Applications\Altium\Datasheets\R0402_Phycomp_RC0402.pdf; Author: CERN DEM JLC; CreateDate: 03.12.2007; LatestRevisionDate: 17.10.2012
U2 = CMP-0188-01370-1: 12-Bit Quad Digital-to-Analog Converter with EEPROM Memory, 10-Pin MSOP, Extended Temperature, Tape and Reel; DatasheetVersion: revE, Oct-2010; ComponentLink2Description: Datasheet; ComponentLink2URL: http://ww1.microchip.com/downloads/en/DeviceDoc/22187E.pdf; PackageReference: MSOP-UN10; PackageDescription: 10-Lead Plastic Micro Small Outline Package (UN) [MSOP]; ComponentLink1Description: Manufacturer URL; PackageVersion: revBB, Aug-2009; ComponentLink3URL: http://www.microchip.com/stellent/groups/techpub_sg/documents/packagingspec/en012702.pdf; ComponentLink3Description: Package Specification; ComponentLink1URL: http://www.microchip.com/

## Sheet USB.SchDoc
size A4
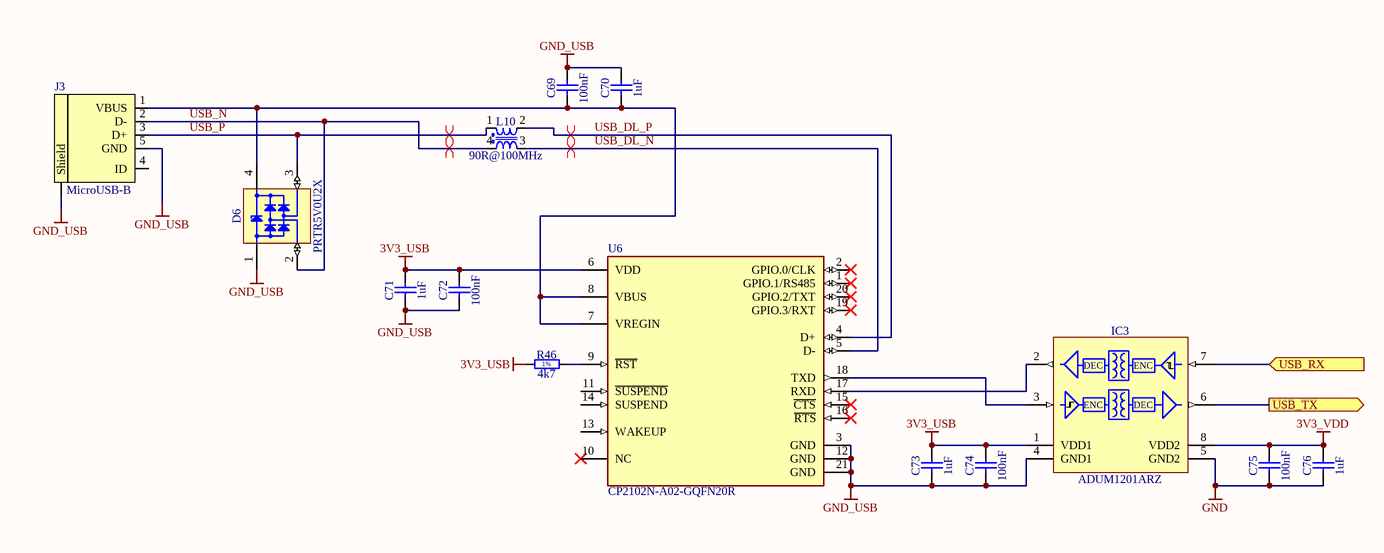
[diagram p6: USB.SchDoc]

### Parts
C69  100nF  [CAPC1005X55N]
C70  1uF  [CAPC1005X55N]
C71  1uF  [CAPC1005X55N]
C72  100nF  [CAPC1005X55N]
C73  1uF  [CAPC1005X55N]
C74  100nF  [CAPC1005X55N]
C75  100nF  [CAPC1005X55N]
C76  1uF  [CAPC1005X55N]
D6  PRTR5V0U2X  [SOT190P230X110-4N]
IC3  ADUM1201ARZ  [SOIC127P600X175-8N]
J3  MicroUSB-B  [USB-Micro-B-RA-SMD-PiP]
L10  90R@100MHz  [IND_MURATA_DLW21S]
R46  4k7  [RESC1005X40N]
U6  CP2102N-A02-GQFN20R  [FP-CP2102N-A02-GQFN20R-MFG]

### Ports
USB_RX (in), USB_TX (out)

### Nets
3V3_USB: C71.2 C72.2 C73.2 C74.2 IC3.1(VDD1) R46.1 U6.6(VDD)
3V3_VDD: C75.2 C76.2 IC3.8(VDD2)
GND: C75.1 C76.1 IC3.5(GND2)
GND_USB: C69.2 C70.2 C71.1 C72.1 C73.1 C74.1 D6.1(GND) IC3.4(GND1) J3.5(GND) J3.6(Shield) U6.3(GND) U6.12(GND) U6.21(GND)
UART_RX: IC3.6(VOB) ; port USB_TX
UART_TX: IC3.7(VIA) ; port USB_RX
USB_DL_N: L10.3 U6.5(D-)
USB_DL_P: L10.2 U6.4(D+)
USB_N: D6.2(I/O1) J3.2(D-) L10.4
USB_P: D6.3(I/O2) J3.3(D+) L10.1
NetC69_1: C69.1 C70.1 D6.4(VCC) J3.1(VBUS) U6.7(VREGIN) U6.8(VBUS)
NetIC3_2: IC3.2(VOA) U6.17(RXD)
NetIC3_3: IC3.3(VIB) U6.18(TXD)
NetR46_2: R46.2 U6.9(~{RST})

Not connected (* = marked no-connect by the designer): J3 4(ID); U6 1(GPIO.1/RS485)* 2(GPIO.0/CLK)* 10(NC)* 11(~{SUSPEND}) 13(WAKEUP) 14(SUSPEND) 15(~{CTS})* 16(~{RTS})* 19(GPIO.3/RXT)* 20(GPIO.2/TXT)*

### Layout directives
differential pair: USB_DL_N, USB_DL_P, USB_N, USB_P

### Notes on the sheet
- (in symbol ADUM1201ARZ) DEC; ENC
- (in symbol R0402_4K7_1%_0.0625W_100PPM) 1%

### Library data of the parts
C69 C72 C74 C75 = CC0402_100NF_16V_10%_X5R: Non-polarised capacitor; Part Description: SMD Multilayer Chip Ceramic Capacitor; Manufacturer: GENERIC; Manufacturer1 Part Number: GRM155R61C104KA88D; Voltage: 16V; TC: X5R; Tolerance: ±10%; Part Number: CC0402_100NF_16V_10%_X5R; Component Kind: Standard; Component Type: Standard; Pin Count: 2; Value: 100nF; Status: None; Manufacturer Part Number: CC0402_100NF_16V_10%_X5R; Case: 0402; Mounted: Yes; Socket: No; SMD: Yes; Sense: No; Manufacturer1 Example: MURATA; Manufacturer1 ComponentHeight: 0.55mm; HelpURL: \\cern.ch\dfs\Applications\Altium\Datasheets\CC0402_X5R_MURATA_GRM.pdf; Author: CERN DEM JLC; CreateDate: 10.12.2013; LatestRevisionDate: 10.12.2013
C70 C71 C73 C76 = CC0402_1UF_16V_10%_X5R: as C66 on sheet VCSEL; Part Number: CC0402_1UF_16V_10%_X5R; Component Kind: Standard; Component Type: Standard; Pin Count: 2; Value: 1uF; Status: Preferred; Manufacturer Part Number: CC0402_1UF_16V_10%_X5R; Case: 0402; Mounted: Yes; Socket: No; SMD: Yes; Sense: No; Manufacturer1 Example: TDK; Manufacturer1 ComponentHeight: 0.55mm; HelpURL: \\cern.ch\dfs\Applications\Altium\Datasheets\CC0402_X5R_TDK_C.pdf; Author: CERN DEM JLC; CreateDate: 25.10.2012; LatestRevisionDate: 25.10.2012
D6 = PRTR5V0U2X: Ultra Low Capacitance Double Rail-to-Rail ESD Protection Diode; Part Description: Ultra Low Capacitance (1pF) Double Rail-to-Rail ESD Protection Diode (8kV); Manufacturer: NXP SEMICONDUCTORS; Voltage: 5.5V; PressFit: No; Bonding: No; Part Number: PRTR5V0U2X; Component Kind: Standard; Component Type: Standard; Device: PRTR5V0U2X; PackageDescription: SOT143B, SOT, 1.90mm Pitch; 4 Pin, 1.30mm W X 2.90mm L X 1.10mm H body, IPC Medium Density; Manufacturer Part Number: PRTR5V0U2X; Pin Count: 4; Case: SOT143B; Mounted: Yes; Socket: No; SMD: Yes; Sense: No; ComponentHeight: 1.1mm; HelpURL: \\cern.ch\dfs\Applications\Altium\Datasheets\PRTR5V0U2X.pdf; Author: CERN DEM JLC; CreateDate: 22.03.2011; LatestRevisionDate: 22.03.2011
IC3 = ADUM1201ARZ: Dual-Channel Digital Isolators; Manufacturer: ANALOG DEVICES; PressFit: No; Bonding: No; Part Number: ADUM1201ARZ; Component Kind: Standard; Component Type: Standard; Device: ADUM1201ARZ; PackageDescription: SOIC 8, Pitch 1.27mm - Body 4x5mm, IPC Medium Density; Part Description: Dual-Channel Digital Isolator; Manufacturer Part Number: ADUM1201ARZ; Pin Count: 8; Case: SOIC8; Mounted: Yes; Socket: No; SMD: Yes; Sense: No; ComponentHeight: 1.75mm; Author: CERN DEM BC; HelpURL: \\cern.ch\dfs\Applications\Altium\Datasheets\ADUM1201ARZ.pdf; CreateDate: 31.07.2015; LatestRevisionDate: 31.07.2015
J3 = MiniUSB-AB-SMT: MicroUSB-B-SMT; Manufacturer: Allen Creations Corp.; Manufacturer Part Number: AJU55-BS2111-L; 2nd source part number: 609-4616-1-ND; Artikkelnr Noca: 55029020; Artikkelnr Simpro: N.A.; Part Number: USB-Micro-B-RA-SMD-PiP; Datasheet: \\hizz\pro\app9717\Datasheet\connectores\Allen Creations Corp\AJU-211.pdf; Footprint Doc: USB-Micro-B-RA-SMD-PiP; LatestRevisionDate: 2016-04-21; Pin Count: 5; Publisher: Nordic Semiconductor; Published: 2014-10-07; Value: MicroUSB-B; Note: *; Supplier: Cabcon; Supplier part number: AJU55-BS2111-L; 2nd source Supplier: Digi-Key
L10 = IND_MURATA_DLW21SN900SQ2L: Inductor Common Mode; Part Description: Wire Wound Common Mode Choke Coil (DLW21S Series); Manufacturer: MURATA; Power: 330mA; Resistance: 0.35R; Tolerance: ±25%; Part Number: IND_MURATA_DLW21SN900SQ2L; Component Kind: Standard; Component Type: Standard; Pin Count: 4; Value: 90R@100MHz; Status: None; Manufacturer Part Number: DLW21SN900SQ2L; Case: 0805; Mounted: Yes; Socket: No; SMD: Yes; Sense: No; ComponentHeight: 1.4mm; HelpURL: \\cern.ch\dfs\Applications\Altium\Datasheets\IND_MURATA_DLW21S.pdf; Author: CERN DEM JLC; CreateDate: 01.07.2014; LatestRevisionDate: 01.07.2014
R46 = R0402_4K7_1%_0.0625W_100PPM: Resistor - 1%; Part Description: General Purpose Thick Film Chip Resistor; Manufacturer: GENERIC; Manufacturer1 Part Number: 232270674702L; TC: ±100ppm/°C; PressFit: No; Part Number: R0402_4K7_1%_0.0625W_100PPM; Component Kind: Standard; Component Type: Standard; Pin Count: 2; Value: 4k7; Status: Not Recommended; Power: 0.0625W; Tolerance: ±1%; Manufacturer Part Number: R0402_4K7_1%_0.0625W_100PPM; Case: 0402; Mounted: Yes; Sense: No; Socket: No; SMD: Yes; Manufacturer1 Example: YAGEO PHYCOMP; Manufacturer1 ComponentHeight: 0.4mm; HelpURL: \\cern.ch\dfs\Applications\Altium\Datasheets\R0402_Phycomp_RC0402.pdf; Author: CERN DEM JLC; CreateDate: 03.12.2007; LatestRevisionDate: 17.10.2012
U6 = CMP-08107-000007-1: IC USB TO UART BRIDGE QFN20

## Sheet TEC_controller.SchDoc
size A4
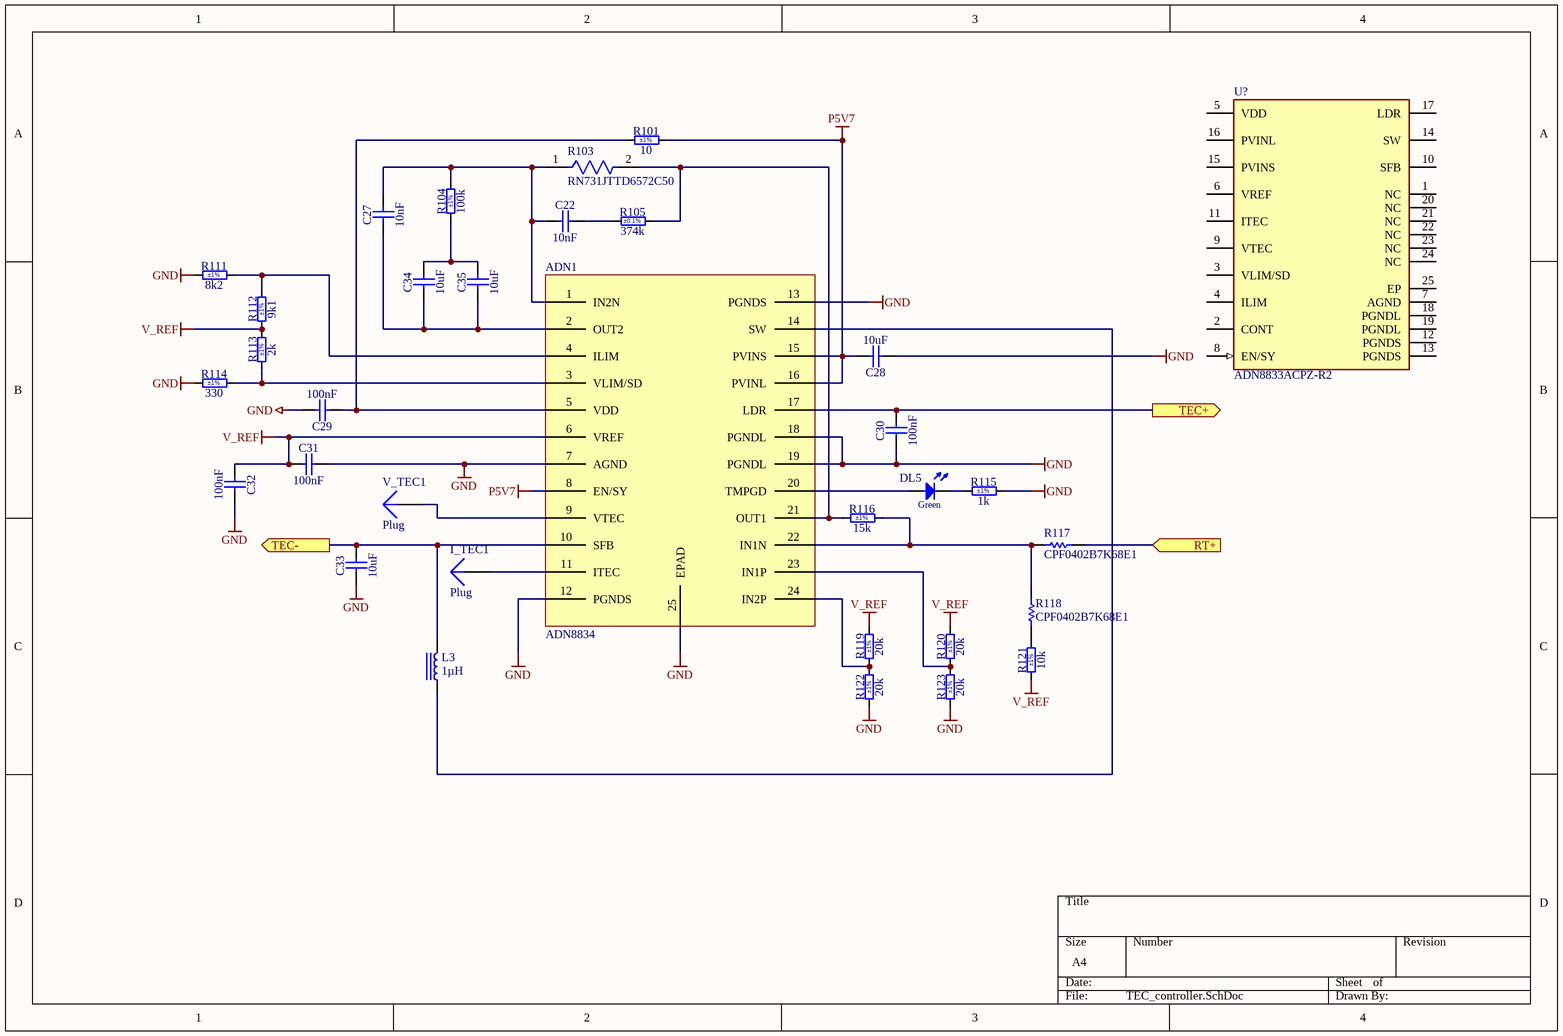
[diagram p7: TEC_controller.SchDoc]

### Parts
ADN1  ADN8834  [SMSC QFN-24 4x4MM]
C22  10nF  [CAPC1005X55N]
C27  10nF  [CAPC1005X55N]
C28  10uF  [CAPC1005X70N]
C29  100nF  [CAPC1005X55N]
C30  100nF  [CAPC1005X55N]
C31  100nF  [CAPC1005X55N]
C32  100nF  [CAPC1005X55N]
C33  10uF  [CAPC1005X70N]
C34  10uF  [CAPC1608X80N]
C35  10uF  [CAPC1608X80N]
DL5  Green  [LED_OSRAM_LGL29K]
I_TEC1  Plug  [PIN1]
L3  1µH  [IND 0806_2016]
R101  10  Tolerance: ±1%  [RESC1005X40N]
R103  RN731JTTD6572C50  [FP-RN731J-IPC_B]
R104  100k  Tolerance: ±1%  [RESC1005X40N]
R105  374k  Tolerance: ±0.1%  [RESC1608X55N]
R111  8k2  Tolerance: ±1%  [RESC1005X40N]
R112  9k1  Tolerance: ±1%  [RESC1005X40N]
R113  2k  Tolerance: ±1%  [RESC1005X40N]
R114  330  Tolerance: ±1%  [RESC1005X40N]
R115  1k  Tolerance: ±1%  [RESC1005X40N]
R116  15k  Tolerance: ±1%  [RESC1005X40N]
R117  CPF0402B7K68E1  [RESC1005X35X20NL05T10]
R118  CPF0402B7K68E1  [RESC1005X35X20NL05T10]
R119  20k  Tolerance: ±1%  [RESC1005X40N]
R120  20k  Tolerance: ±1%  [RESC1005X40N]
R121  10k  Tolerance: ±1%  [RESC1005X40N]
R122  20k  Tolerance: ±1%  [RESC1005X40N]
R123  20k  Tolerance: ±1%  [RESC1005X40N]
U?  ADN8833ACPZ-R2  [FP-CP-24-15-IPC_C]
V_TEC1  Plug  [PIN1]

### Ports
RT+ (in), TEC+ (out), TEC- (out)

### Nets
GND: ADN1.7(AGND) ADN1.12(PGNDS) ADN1.13(PGNDS) ADN1.18(PGNDL) ADN1.19(PGNDL) ADN1.25(EPAD) C28.1 C29.2 C30.1 C31.2 C32.2 C33.1 R111.1 R114.1 R115.2 R122.1 R123.1
P5V7: ADN1.8(EN/SY) ADN1.15(PVINS) ADN1.16(PVINL) C28.2 R101.2
V_REF: ADN1.6(VREF) C31.1 C32.1 R112.1 R113.2 R119.2 R120.2 R121.1
ADC_TC: R117.2 ; port RT+
NetADN1_1: ADN1.1(IN2N) C22.1 C27.2 R103.1 R104.2
NetADN1_2: ADN1.2(OUT2) C27.1 C34.1 C35.1
NetADN1_3: ADN1.3(VLIM/SD) R113.1 R114.2
NetADN1_4: ADN1.4(ILIM) R111.2 R112.2
NetADN1_5: ADN1.5(VDD) C29.1 R101.1
NetADN1_9: ADN1.9(VTEC) V_TEC1.1
NetADN1_10: ADN1.10(SFB) C33.2 L3.2 ; port TEC-
NetADN1_11: ADN1.11(ITEC) I_TEC1.1
NetADN1_14: ADN1.14(SW) L3.1
NetADN1_17: ADN1.17(LDR) C30.2 ; port TEC+
NetADN1_20: ADN1.20(TMPGD) DL5.2(A)
NetADN1_21: ADN1.21(OUT1) R103.2 R105.2 R116.1
NetADN1_22: ADN1.22(IN1N) R116.2 R117.1 R118.2
NetADN1_23: ADN1.23(IN1P) R120.1 R123.2
NetADN1_24: ADN1.24(IN2P) R119.1 R122.2
NetC22_2: C22.2 R105.1
NetC34_2: C34.2 C35.2 R104.1
NetDL5_1: DL5.1(C) R115.1
NetR118_1: R118.1 R121.2

Not connected (* = marked no-connect by the designer): U? 1(NC) 2(CONT) 3(VLIM/SD) 4(ILIM) 5(VDD) 6(VREF) 7(AGND) 8(EN/SY) 9(VTEC) 10(SFB) 11(ITEC) 12(PGNDS) 13(PGNDS) 14(SW) 15(PVINS) 16(PVINL) 17(LDR) 18(PGNDL) 19(PGNDL) 20(NC) 21(NC) 22(NC) 23(NC) 24(NC) 25(EP)

### Library data of the parts
ADN1 = ADN8834: TEC
C22 C27 = CC0402_10NF_16V_10%_X7R: as C101 on sheet VCSEL; Part Number: CC0402_10NF_16V_10%_X7R; Component Kind: Standard; Component Type: Standard; Pin Count: 2; Value: 10nF; Status: Not Recommended; Manufacturer Part Number: CC0402_10NF_16V_10%_X7R; Case: 0402; Mounted: Yes; Socket: No; SMD: Yes; Sense: No; Manufacturer1 Example: PHYCOMP; Manufacturer1 ComponentHeight: 0.55mm; HelpURL: \\cern.ch\dfs\Applications\Altium\Datasheets\CC0402_X7R_PHYCOMP.pdf; Author: CERN DEM JLC; CreateDate: 03.12.2007; LatestRevisionDate: 03.12.2007
C28 C33 = CC0402_10UF_6.3V_20%_X5R: Non-polarised capacitor; Part Description: SMD Multilayer Chip Ceramic Capacitor; Manufacturer: GENERIC; Manufacturer1 Part Number: C1005X5R0J106M050BC; Voltage: 6.3V; TC: X5R; Tolerance: ±10%; Part Number: CC0402_10UF_6.3V_20%_X5R; Component Kind: Standard; Component Type: Standard; Pin Count: 2; Value: 10uF; Status: Preferred; Manufacturer Part Number: CC0402_10UF_6.3V_20%_X5R; Case: 0402; Mounted: Yes; Socket: No; SMD: Yes; Sense: No; Manufacturer1 Example: TDK; Manufacturer1 ComponentHeight: 0.70mm; HelpURL: \\cern.ch\dfs\Applications\Altium\Datasheets\CC0402_X5R_TDK_C.pdf; Author: CERN DEM JLC; CreateDate: 07.01.2015; LatestRevisionDate: 07.01.2015
C29-C32 = CC0402_100NF_16V_10%_X7R: as C65 on sheet VCSEL; Part Number: CC0402_100NF_16V_10%_X7R; Component Kind: Standard; Component Type: Standard; Pin Count: 2; Value: 100nF; Status: Not Recommended; Manufacturer Part Number: CC0402_100NF_16V_10%_X7R; Case: 0402; Mounted: Yes; Socket: No; SMD: Yes; Sense: No; Manufacturer1 Example: MURATA; Manufacturer1 ComponentHeight: 0.55mm; HelpURL: \\cern.ch\dfs\Applications\Altium\Datasheets\CC0402_X7R_MURATA_GRM.pdf; Author: CERN DEM JLC; CreateDate: 05.12.2013; LatestRevisionDate: 03.12.2007
C34 C35 = CC0603_10UF_16V_20%_X5R: Non-polarised capacitor; Part Description: SMD Multilayer Chip Ceramic Capacitor; Manufacturer: GENERIC; Manufacturer1 Part Number: GRM188R61C106MA73D; Voltage: 16V; TC: X5R; Tolerance: ±20%; Part Number: CC0603_10UF_16V_20%_X5R; Component Kind: Standard; Component Type: Standard; Pin Count: 2; Value: 10uF; Status: None; Manufacturer Part Number: CC0603_10UF_16V_20%_X5R; Case: 0603; Mounted: Yes; Socket: No; SMD: Yes; Sense: No; Manufacturer1 Example: MURATA; Manufacturer1 ComponentHeight: 0.8mm; HelpURL: \\cern.ch\dfs\Applications\Altium\Datasheets\CC0603_X5R_MURATA_GRM.pdf; Author: CERN DEM MR; CreateDate: 02.03.2016; LatestRevisionDate: 02.03.2016
DL5 = LED_OSRAM_LG L29K-G2J1-24-Z: LED Green 1C 2A; Part Description: Surface Mount Green LED (0603 Case); Manufacturer: OSRAM; PressFit: No; Bonding: No; Status Comment: Sourcing Difficulty; Part Number: LED_OSRAM_LG L29K-G2J1-24-Z; Component Kind: Standard; Component Type: Standard; Color: Green; PackageDescription: Green Chip LED, 2-Leads, Body 1.7x0.8mm, IPC Medium Density; Manufacturer Part Number: LG L29K-G2J1-24-Z; Pin Count: 2; Case: 0603; Mounted: Yes; Socket: No; SMD: Yes; Sense: No; ComponentHeight: 0.67mm; HelpURL: \\cern.ch\dfs\Applications\Altium\Datasheets\LED_OSRAM_LGL29K.pdf; Author: CERN DEM JLC; CreateDate: 24.04.2012; LatestRevisionDate: 24.04.2012; Status: Not Recommended
L3 = SDED20161T-1R0MS: FIXED IND 1UH 1.7A 107MOHM SMD; Manufacturer: Delta Electronics/Cyntec; Current - Saturation: 1.8A; DC Resistance (DCR): 107mOhm Max; Inductance Frequency - Test: 1MHz; Material - Core: 0806 (2016 Metric); Shielding: Shielded; Tolerance: ±20%; Part Number: SDED20161T-1R0MS; ComponentLink1Description: Datasheet; ComponentLink1URL: http://www.cyntec.com/upfile/products/download/SDED20161T-000%20(A6).pdf; ComponentLink2Description: DigiKey Link; ComponentLink2URL: http://digikey.com/product-detail/en/delta-electronics-cyntec/SDED20161T-1R0MS/2037-SDED20161T-1R0MSCT-ND/10315404; Current Rating (Amps): 1.7A; Device Package: 0806 (2016 Metric); Height - Seated (Max): 0.039" (1.00mm); Inductance: 1µH; LastUpdated: 02.09.2020 01:24:38; Lifecycle Status: Active; Minimum Order: 1; Mounting Type: Surface Mount; Operating Temperature: -55°C ~ 125°C; Package / Case: 0806 (2016 Metric); Packaging: TapeAndReel; PartId: 2787; Part Status: Active; Price: 0.09; Series: SDED20161T; Size / Dimension: 0.079" L x 0.063" W (2.00mm x 1.60mm); Supplier 1: DigiKey; Supplier Part Number 1: 2037-SDED20161T-1R0MSCT-ND; Supplier Device Package: 0806; Value: 1µH
R101 = R0402_10R_1%_0.0625W_200PPM: Resistor - 1%; Part Description: General Purpose Thick Film Chip Resistor; Manufacturer: GENERIC; Manufacturer1 Part Number: 232270671009L; TC: ±200ppm/°C; PressFit: No; Part Number: R0402_10R_1%_0.0625W_200PPM; Component Kind: Standard; Component Type: Standard; Pin Count: 2; Value: 10; Status: Not Recommended; Power: 0.0625W; Manufacturer Part Number: R0402_10R_1%_0.0625W_200PPM; Case: 0402; Mounted: Yes; Sense: No; Socket: No; SMD: Yes; Manufacturer1 Example: YAGEO PHYCOMP; Manufacturer1 ComponentHeight: 0.4mm; HelpURL: \\cern.ch\dfs\Applications\Altium\Datasheets\R0402_Phycomp_RC0402.pdf; Author: CERN DEM JLC; CreateDate: 24.06.2009; LatestRevisionDate: 17.10.2012
R103 = CMP-04015-036220-1: 65.7kΩ ±0.25% 0.063W, 1/16W Chip Resistor 0603 (1608 Metric) Moisture Resistant Thin Film; Voltage Rating: 50V; Resistance: 65.7kR; Temperature Coefficient: 50ppm/°C; Power Rating: 63mW; Case Code (Metric): 1608; Length: 1.6mm; Packaging: Tape and Reel; Case/Package: 0603; Case Code (Imperial): 0603; Weight: 7.1E-05oz; Composition: Thin Film; Height: 0.45mm; Tolerance: 0.25%; Termination: SMD/SMT; Width: 0.8mm; Min Operating Temperature: -55°C; Max Operating Temperature: 125°C
R104 = R0402_100K_1%_0.0625W_100PPM: Resistor - 1%; Part Description: General Purpose Thick Film Chip Resistor; Manufacturer: GENERIC; Manufacturer1 Part Number: 232270671004L; TC: ±100ppm/°C; PressFit: No; Part Number: R0402_100K_1%_0.0625W_100PPM; Component Kind: Standard; Component Type: Standard; Pin Count: 2; Value: 100k; Status: Not Recommended; Power: 0.0625W; Manufacturer Part Number: R0402_100K_1%_0.0625W_100PPM; Case: 0402; Mounted: Yes; Sense: No; Socket: No; SMD: Yes; Manufacturer1 Example: YAGEO PHYCOMP; Manufacturer1 ComponentHeight: 0.4mm; HelpURL: \\cern.ch\dfs\Applications\Altium\Datasheets\R0402_Phycomp_RC0402.pdf; Author: CERN DEM JLC; CreateDate: 03.12.2007; LatestRevisionDate: 17.10.2012
R105 = R0603_374K_0.1%_0.063W_25PPM: Resistor - 0.1%; Part Description: Thin Film Chip Resistor; Manufacturer: GENERIC; Manufacturer1 Part Number: CPF0603B374KE1; Power: 0.063W; TC: ±25ppm; PressFit: No; Part Number: R0603_374K_0.1%_0.063W_25PPM; Component Kind: Standard; Component Type: Standard; Pin Count: 2; Value: 374k; Status: Not Recommended; Manufacturer Part Number: R0603_374K_0.1%_0.063W_25PPM; Case: 0603; Mounted: Yes; Sense: No; Socket: No; SMD: Yes; Manufacturer1 Example: TYCO ELECTRONICS; Manufacturer1 ComponentHeight: 0.55mm; HelpURL: \\cern.ch\dfs\Applications\Altium\Datasheets\R0603_TYCO_CPF.pdf; Author: CERN DEM JLC; CreateDate: 12.01.2011; LatestRevisionDate: 12.01.2011
R111 = R0402_8K2_1%_0.0625W_100PPM: Resistor - 1%; Part Description: General Purpose Thick Film Chip Resistor; Manufacturer: GENERIC; Manufacturer1 Part Number: 232270678202L; TC: ±100ppm/°C; PressFit: No; Part Number: R0402_8K2_1%_0.0625W_100PPM; Component Kind: Standard; Component Type: Standard; Pin Count: 2; Value: 8k2; Status: Not Recommended; Power: 0.0625W; Manufacturer Part Number: R0402_8K2_1%_0.0625W_100PPM; Case: 0402; Mounted: Yes; Sense: No; Socket: No; SMD: Yes; Manufacturer1 Example: YAGEO PHYCOMP; Manufacturer1 ComponentHeight: 0.4mm; HelpURL: \\cern.ch\dfs\Applications\Altium\Datasheets\R0402_Phycomp_RC0402.pdf; Author: CERN DEM JLC; CreateDate: 03.12.2007; LatestRevisionDate: 17.10.2012
R112 = R0402_9K1_1%_0.0625W_100PPM: Resistor - 1%; Part Description: General Purpose Thick Film Chip Resistor; Manufacturer: GENERIC; Manufacturer1 Part Number: 232270679102L; TC: ±100ppm/°C; PressFit: No; Part Number: R0402_9K1_1%_0.0625W_100PPM; Component Kind: Standard; Component Type: Standard; Pin Count: 2; Value: 9k1; Status: Not Recommended; Power: 0.0625W; Manufacturer Part Number: R0402_9K1_1%_0.0625W_100PPM; Case: 0402; Mounted: Yes; Sense: No; Socket: No; SMD: Yes; Manufacturer1 Example: YAGEO PHYCOMP; Manufacturer1 ComponentHeight: 0.4mm; HelpURL: \\cern.ch\dfs\Applications\Altium\Datasheets\R0402_Phycomp_RC0402.pdf; Author: CERN DEM JLC; CreateDate: 03.12.2007; LatestRevisionDate: 17.10.2012
R113 = R0402_2K_1%_0.0625W_100PPM: Resistor - 1%; Part Description: General Purpose Thick Film Chip Resistor; Manufacturer: GENERIC; Manufacturer1 Part Number: 232270672002L; TC: ±100ppm/°C; PressFit: No; Part Number: R0402_2K_1%_0.0625W_100PPM; Component Kind: Standard; Component Type: Standard; Pin Count: 2; Value: 2k; Status: Not Recommended; Power: 0.0625W; Manufacturer Part Number: R0402_2K_1%_0.0625W_100PPM; Case: 0402; Mounted: Yes; Sense: No; Socket: No; SMD: Yes; Manufacturer1 Example: YAGEO PHYCOMP; Manufacturer1 ComponentHeight: 0.4mm; HelpURL: \\cern.ch\dfs\Applications\Altium\Datasheets\R0402_Phycomp_RC0402.pdf; Author: CERN DEM JLC; CreateDate: 03.12.2007; LatestRevisionDate: 17.10.2012
R114 = R0402_330R_1%_0.0625W_100PPM: Resistor - 1%; Part Description: General Purpose Thick Film Chip Resistor; Manufacturer: GENERIC; Manufacturer1 Part Number: 232270673301L; TC: ±100ppm/°C; PressFit: No; Part Number: R0402_330R_1%_0.0625W_100PPM; Component Kind: Standard; Component Type: Standard; Pin Count: 2; Value: 330; Status: Not Recommended; Power: 0.0625W; Manufacturer Part Number: R0402_330R_1%_0.0625W_100PPM; Case: 0402; Mounted: Yes; Sense: No; Socket: No; SMD: Yes; Manufacturer1 Example: YAGEO PHYCOMP; Manufacturer1 ComponentHeight: 0.4mm; HelpURL: \\cern.ch\dfs\Applications\Altium\Datasheets\R0402_Phycomp_RC0402.pdf; Author: CERN DEM JLC; CreateDate: 03.12.2007; LatestRevisionDate: 17.10.2012
R115 = R0402_1K_1%_0.0625W_100PPM: Resistor - 1%; Part Description: General Purpose Thick Film Chip Resistor; Manufacturer: GENERIC; Manufacturer1 Part Number: 232270671002L; TC: ±100ppm/°C; PressFit: No; Part Number: R0402_1K_1%_0.0625W_100PPM; Component Kind: Standard; Component Type: Standard; Pin Count: 2; Value: 1k; Status: Not Recommended; Power: 0.0625W; Manufacturer Part Number: R0402_1K_1%_0.0625W_100PPM; Case: 0402; Mounted: Yes; Sense: No; Socket: No; SMD: Yes; Manufacturer1 Example: YAGEO PHYCOMP; Manufacturer1 ComponentHeight: 0.4mm; HelpURL: \\cern.ch\dfs\Applications\Altium\Datasheets\R0402_Phycomp_RC0402.pdf; Author: CERN DEM JLC; CreateDate: 03.12.2007; LatestRevisionDate: 17.10.2012
R116 = R0402_15K_1%_0.0625W_100PPM: Resistor - 1%; Part Description: General Purpose Thick Film Chip Resistor; Manufacturer: GENERIC; Manufacturer1 Part Number: CRCW040215K0FKED; TC: ±100ppm/°C; PressFit: No; Part Number: R0402_15K_1%_0.0625W_100PPM; Component Kind: Standard; Component Type: Standard; Pin Count: 2; Value: 15k; Status: None; Power: 0.0625W; Manufacturer Part Number: R0402_15K_1%_0.0625W_100PPM; Case: 0402; Mounted: Yes; Sense: No; Socket: No; SMD: Yes; Manufacturer1 Example: VISHAY; Manufacturer1 ComponentHeight: 0.4mm; HelpURL: \\cern.ch\dfs\Applications\Altium\Datasheets\R0402_VISHAY_CRCW e3.pdf; Author: CERN DEM JMW; CreateDate: 06.07.2015; LatestRevisionDate: 06.07.2015
R117 R118 = CMP-2002-03387-1: Manufacturer: TE Connectivity / AMP; Part Number: CPF0402B7K68E1
R119 R120 R122 R123 = R0402_20K_1%_0.0625W_100PPM: Resistor - 1%; Part Description: General Purpose Thick Film Chip Resistor; Manufacturer: GENERIC; Manufacturer1 Part Number: 232270672003L; TC: ±100ppm/°C; PressFit: No; Part Number: R0402_20K_1%_0.0625W_100PPM; Component Kind: Standard; Component Type: Standard; Pin Count: 2; Value: 20k; Status: Not Recommended; Power: 0.0625W; Manufacturer Part Number: R0402_20K_1%_0.0625W_100PPM; Case: 0402; Mounted: Yes; Sense: No; Socket: No; SMD: Yes; Manufacturer1 Example: YAGEO PHYCOMP; Manufacturer1 ComponentHeight: 0.4mm; HelpURL: \\cern.ch\dfs\Applications\Altium\Datasheets\R0402_Phycomp_RC0402.pdf; Author: CERN DEM JLC; CreateDate: 03.12.2007; LatestRevisionDate: 17.10.2012
R121 = R0402_10K_1%_0.0625W_100PPM: as R41 on sheet VCSEL; Part Number: R0402_10K_1%_0.0625W_100PPM; Component Kind: Standard; Component Type: Standard; Pin Count: 2; Value: 10k; Status: Not Recommended; Power: 0.0625W; Manufacturer Part Number: R0402_10K_1%_0.0625W_100PPM; Case: 0402; Mounted: Yes; Sense: No; Socket: No; SMD: Yes; Manufacturer1 Example: YAGEO PHYCOMP; Manufacturer1 ComponentHeight: 0.4mm; HelpURL: \\cern.ch\dfs\Applications\Altium\Datasheets\R0402_Phycomp_RC0402.pdf; Author: CERN DEM JLC; CreateDate: 03.12.2007; LatestRevisionDate: 17.10.2012
U? = CMP-09131-000026-1: IC THERMO COOLER DRIVER 24LFCSP; Max Supply Voltage: 5.5V; Operating Supply Current: 2.1mA; Min Supply Voltage: 2.7V; RoHS Compliant: Yes; Mount: Surface Mount; Number of Pins: 24; Packaging: Cut Tape; Lead Free: Contains Lead; REACH SVHC: No SVHC; Max Operating Temperature: 125°C; Min Operating Temperature: -40°C
I_TEC1 V_TEC1 = Plug: LatestRevisionDate: 17-Jul-2002; LatestRevisionNote: Re-released for DXP Platform.; Publisher: Altium Limited